# Altium schematic sheet Filter5.SchDoc
size 420 x 297 mm; SheetNumber: 10; SheetTotal: 13
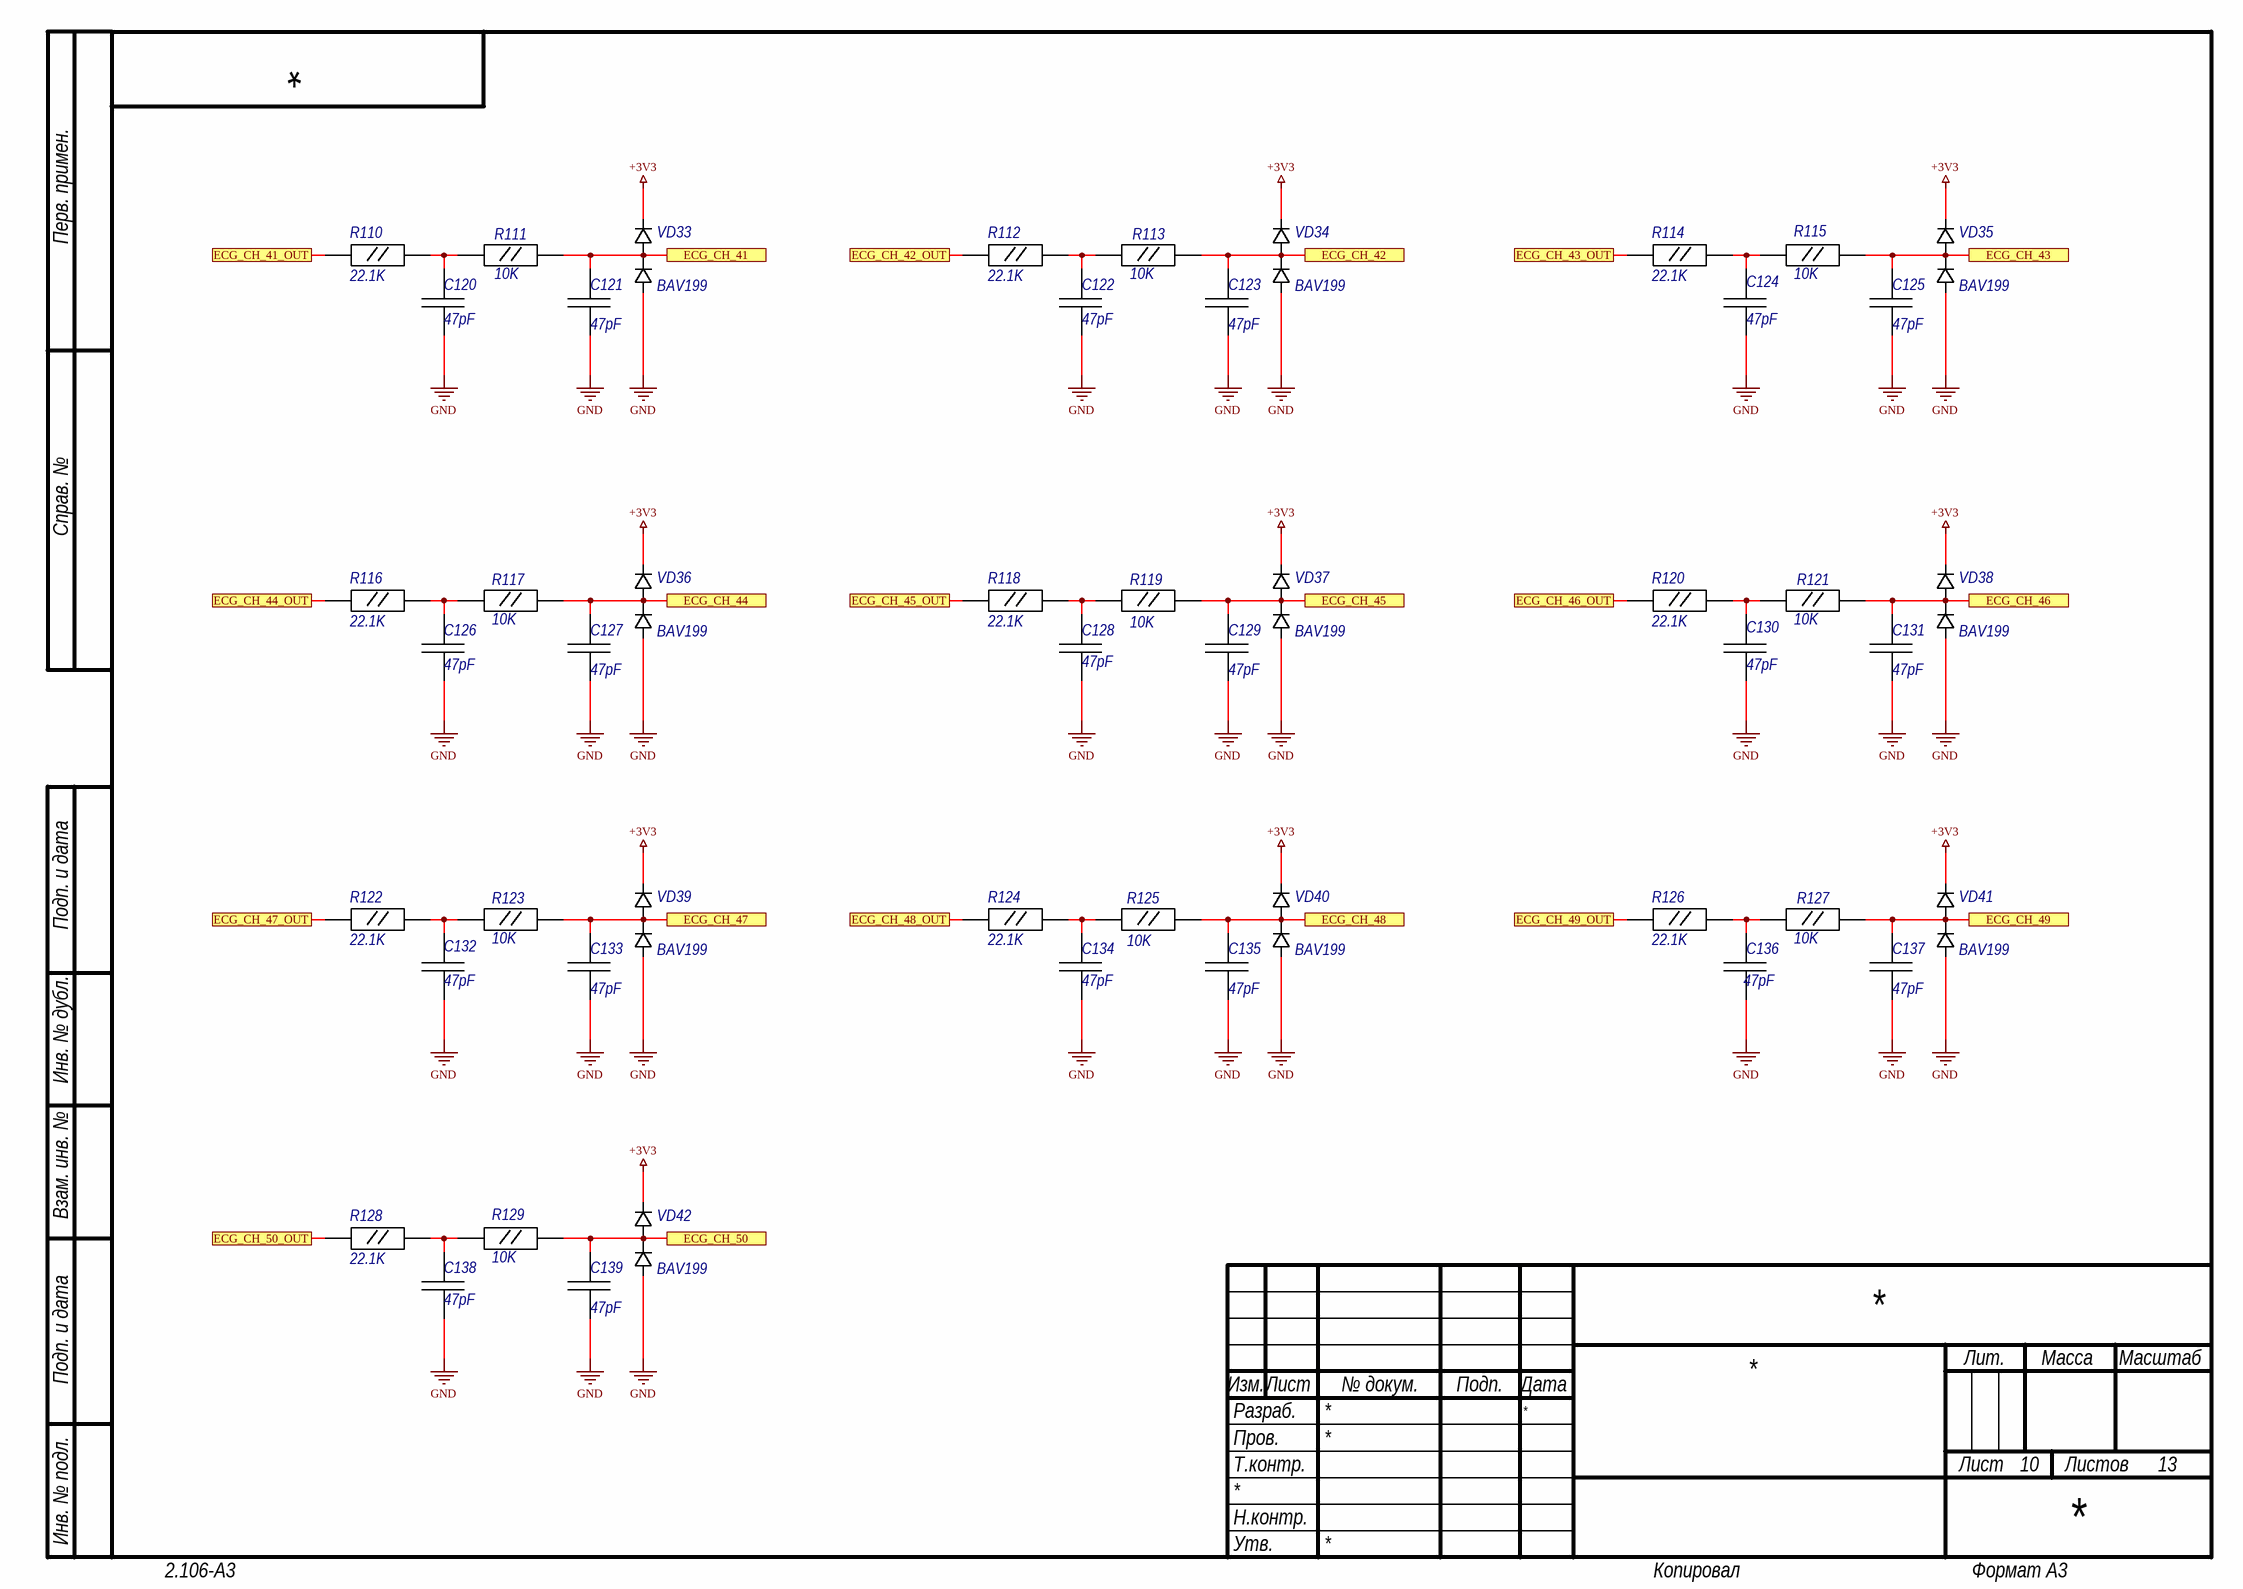
[diagram p0: Filter5.SchDoc]

## Parts
C120  47pF  [C0603]
C121  47pF  [C0603]
C122  47pF  [C0603]
C123  47pF  [C0603]
C124  47pF  [C0603]
C125  47pF  [C0603]
C126  47pF  [C0603]
C127  47pF  [C0603]
C128  47pF  [C0603]
C129  47pF  [C0603]
C130  47pF  [C0603]
C131  47pF  [C0603]
C132  47pF  [C0603]
C133  47pF  [C0603]
C134  47pF  [C0603]
C135  47pF  [C0603]
C136  47pF  [C0603]
C137  47pF  [C0603]
C138  47pF  [C0603]
C139  47pF  [C0603]
R110  22.1K  [R0603]
R111  10K  [R0603]
R112  22.1K  [R0603]
R113  10K  [R0603]
R114  22.1K  [R0603]
R115  10K  [R0603]
R116  22.1K  [R0603]
R117  10K  [R0603]
R118  22.1K  [R0603]
R119  10K  [R0603]
R120  22.1K  [R0603]
R121  10K  [R0603]
R122  22.1K  [R0603]
R123  10K  [R0603]
R124  22.1K  [R0603]
R125  10K  [R0603]
R126  22.1K  [R0603]
R127  10K  [R0603]
R128  22.1K  [R0603]
R129  10K  [R0603]
VD33  BAV199  [SOT23]
VD34  BAV199  [SOT23]
VD35  BAV199  [SOT23]
VD36  BAV199  [SOT23]
VD37  BAV199  [SOT23]
VD38  BAV199  [SOT23]
VD39  BAV199  [SOT23]
VD40  BAV199  [SOT23]
VD41  BAV199  [SOT23]
VD42  BAV199  [SOT23]

## Ports
ECG_CH_41, ECG_CH_41_OUT, ECG_CH_42, ECG_CH_42_OUT, ECG_CH_43, ECG_CH_43_OUT, ECG_CH_44, ECG_CH_44_OUT, ECG_CH_45, ECG_CH_45_OUT, ECG_CH_46, ECG_CH_46_OUT, ECG_CH_47, ECG_CH_47_OUT, ECG_CH_48, ECG_CH_48_OUT, ECG_CH_49, ECG_CH_49_OUT, ECG_CH_50, ECG_CH_50_OUT

## Nets
+3V3: VD33.2 VD34.2 VD35.2 VD36.2 VD37.2 VD38.2 VD39.2 VD40.2 VD41.2 VD42.2
GND: C120.1 C121.1 C122.1 C123.1 C124.1 C125.1 C126.1 C127.1 C128.1 C129.1 C130.1 C131.1 C132.1 C133.1 C134.1 C135.1 C136.1 C137.1 C138.1 C139.1 VD33.1 VD34.1 VD35.1 VD36.1 VD37.1 VD38.1 VD39.1 VD40.1 VD41.1 VD42.1
ECG_CH_41: C121.2 R111.2 VD33.3 ; port ECG_CH_41
ECG_CH_41_OUT: R110.1 ; port ECG_CH_41_OUT
ECG_CH_42: C123.2 R113.2 VD34.3 ; port ECG_CH_42
ECG_CH_42_OUT: R112.1 ; port ECG_CH_42_OUT
ECG_CH_43: C125.2 R115.2 VD35.3 ; port ECG_CH_43
ECG_CH_43_OUT: R114.1 ; port ECG_CH_43_OUT
ECG_CH_44: C127.2 R117.2 VD36.3 ; port ECG_CH_44
ECG_CH_44_OUT: R116.1 ; port ECG_CH_44_OUT
ECG_CH_45: C129.2 R119.2 VD37.3 ; port ECG_CH_45
ECG_CH_45_OUT: R118.1 ; port ECG_CH_45_OUT
ECG_CH_46: C131.2 R121.2 VD38.3 ; port ECG_CH_46
ECG_CH_46_OUT: R120.1 ; port ECG_CH_46_OUT
ECG_CH_47: C133.2 R123.2 VD39.3 ; port ECG_CH_47
ECG_CH_47_OUT: R122.1 ; port ECG_CH_47_OUT
ECG_CH_48: C135.2 R125.2 VD40.3 ; port ECG_CH_48
ECG_CH_48_OUT: R124.1 ; port ECG_CH_48_OUT
ECG_CH_49: C137.2 R127.2 VD41.3 ; port ECG_CH_49
ECG_CH_49_OUT: R126.1 ; port ECG_CH_49_OUT
ECG_CH_50: C139.2 R129.2 VD42.3 ; port ECG_CH_50
ECG_CH_50_OUT: R128.1 ; port ECG_CH_50_OUT
NetC120_2: C120.2 R110.2 R111.1
NetC122_2: C122.2 R112.2 R113.1
NetC124_2: C124.2 R114.2 R115.1
NetC126_2: C126.2 R116.2 R117.1
NetC128_2: C128.2 R118.2 R119.1
NetC130_2: C130.2 R120.2 R121.1
NetC132_2: C132.2 R122.2 R123.1
NetC134_2: C134.2 R124.2 R125.1
NetC136_2: C136.2 R126.2 R127.1
NetC138_2: C138.2 R128.2 R129.1

## Notes on the sheet
- Перв. примен.
- Справ. №
- Подп. и дата
- Инв. № дубл.
- Взам. инв. №
- Разраб.
- Изм.
- Лист
- № докум.
- Подп.
- Дата
- Лит.
- Масса
- Масштаб
- Пров.
- Т.контр.
- Листов
- Инв. № подл.
- Утв.
- Н.контр.
- 2.106-A3
- Копировал
- Формат А3

## Library data of the parts
C120-C139 = CC_SMD_0603: Ceramic Capacitor SMD; Package: 0603; Value: 47pF
R110-R129 = R0603: Resistor SMD
  R110 R112 R114 R116 R118 R120 R122 R124 R126 R128: Value: 22.1K
  R111 R113 R115 R117 R119 R121 R123 R125 R127 R129: Value: 10K
VD33-VD42 = DIODE_BAV199: Diod Schottky; Diode Type: Standard; Package: SOT-23; PartNumber: BAV199; Manufacturer Part Number 1: BAV199